# EAGLE design control_board (EAGLE 9.6.2)
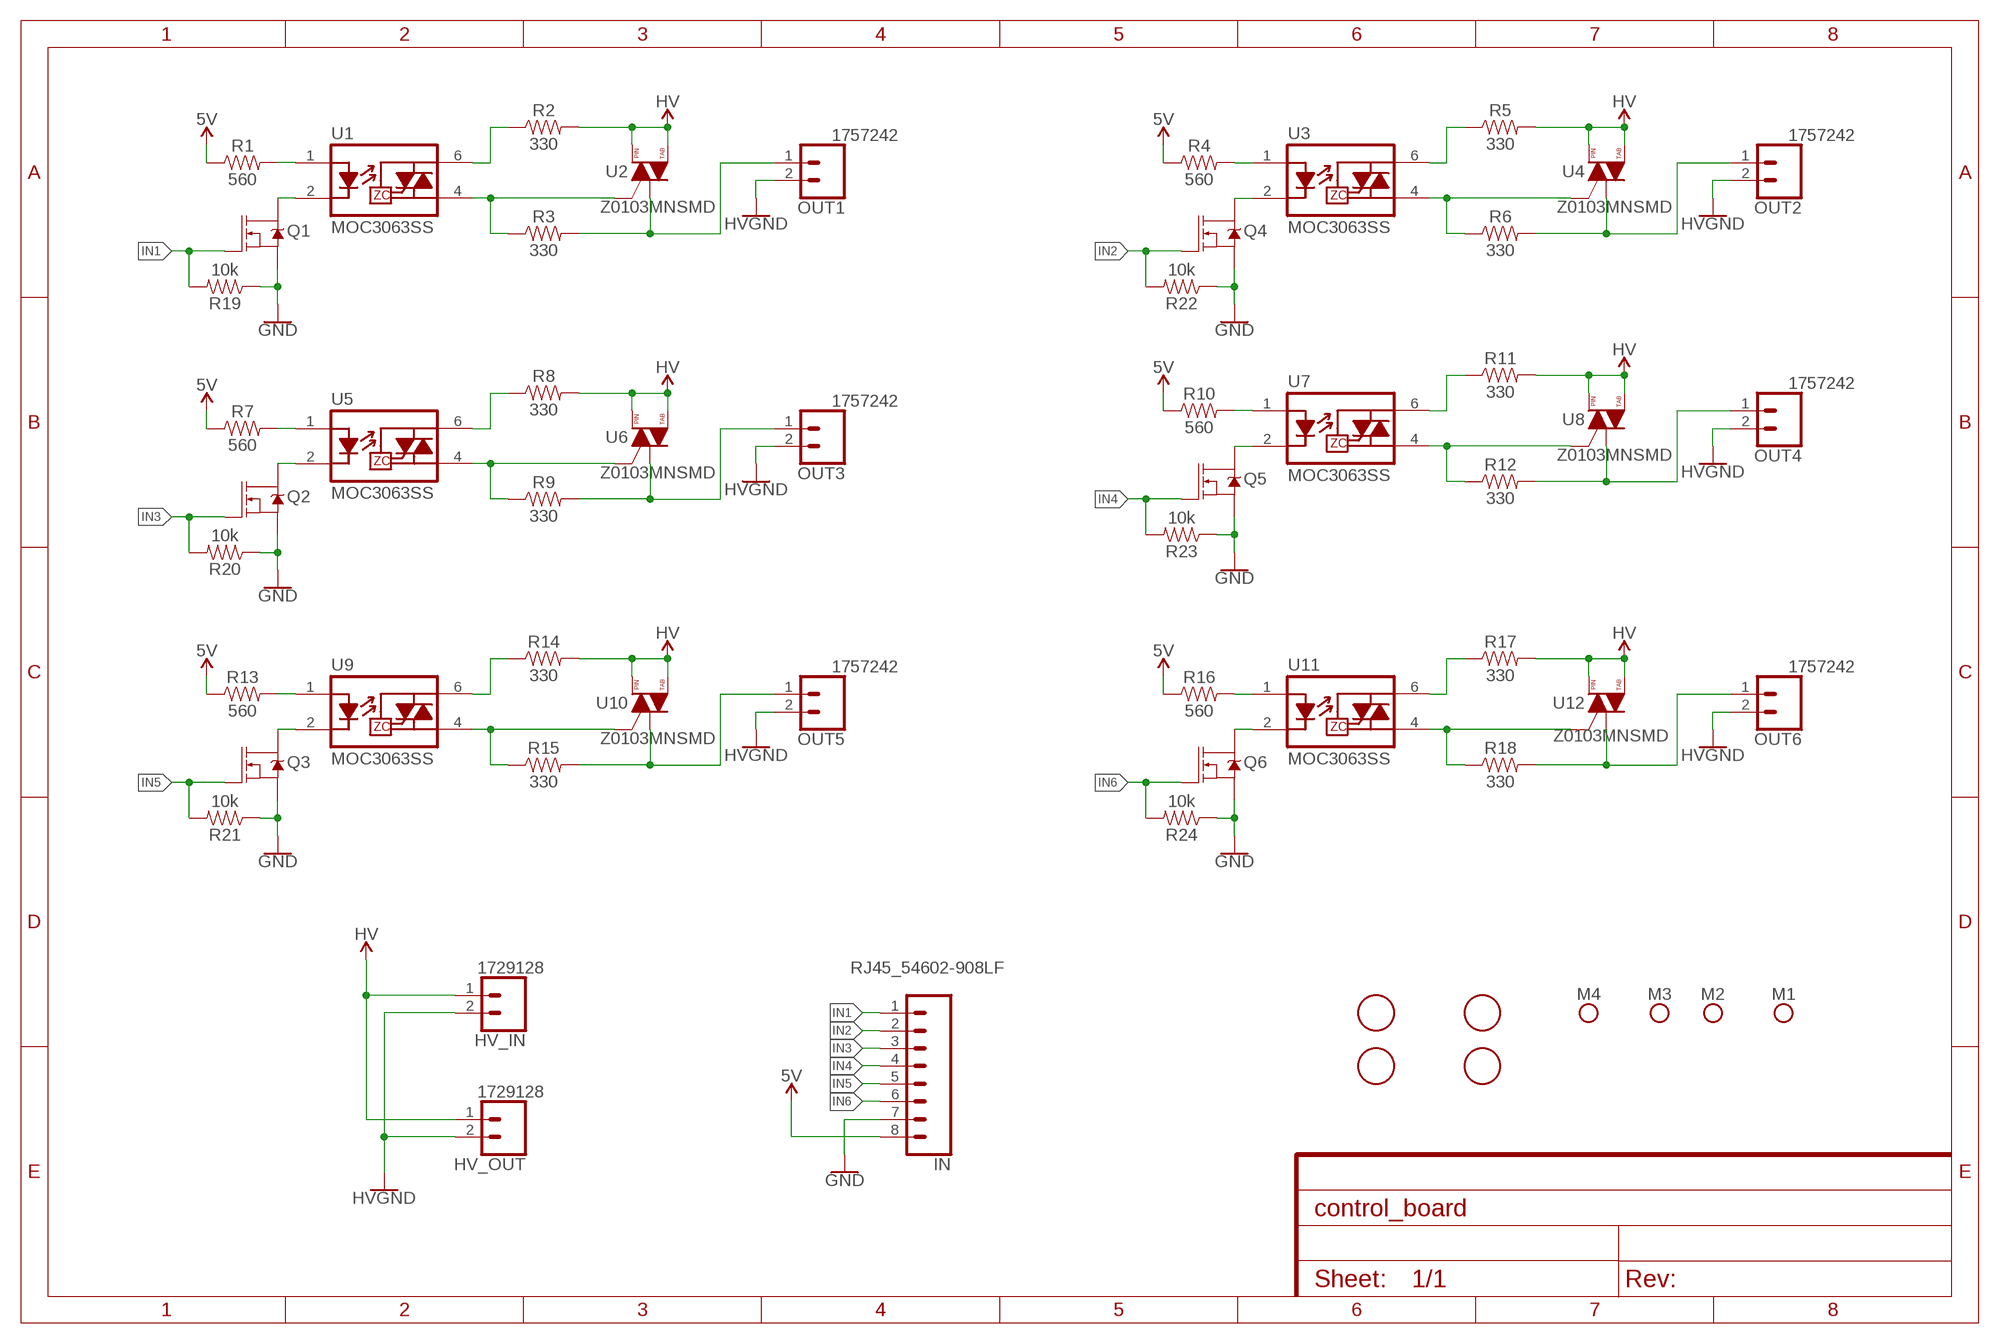
[diagram p0: schematic, sheet 1]

## Parts
HV_IN  1729128  [1729128]
HV_OUT  1729128  [1729128]
IN  RJ45_54602-908LF  [54602-908LF]
M1  NO_BOM  HOLE_ISOLATED-M2.5  [HOLE_ISOLATED_M2.5]
M2  NO_BOM  HOLE_ISOLATED-M2.5  [HOLE_ISOLATED_M2.5]
M3  NO_BOM  HOLE_ISOLATED-M2.5  [HOLE_ISOLATED_M2.5]
M4  NO_BOM  HOLE_ISOLATED-M2.5  [HOLE_ISOLATED_M2.5]
OUT1  1757242  [PHOENIX_1757242]
OUT2  1757242  [PHOENIX_1757242]
OUT3  1757242  [PHOENIX_1757242]
OUT4  1757242  [PHOENIX_1757242]
OUT5  1757242  [PHOENIX_1757242]
OUT6  1757242  [PHOENIX_1757242]
Q1  AO3400A  [SOT95P280X125-3N]
Q2  AO3400A  [SOT95P280X125-3N]
Q3  AO3400A  [SOT95P280X125-3N]
Q4  AO3400A  [SOT95P280X125-3N]
Q5  AO3400A  [SOT95P280X125-3N]
Q6  AO3400A  [SOT95P280X125-3N]
R1  560  RES-1/10W-5%-0603  [R0603]
R2  330  RES-1/10W-5%-0603  [R0603]
R3  330  RES-1/10W-5%-0603  [R0603]
R4  560  RES-1/10W-5%-0603  [R0603]
R5  330  RES-1/10W-5%-0603  [R0603]
R6  330  RES-1/10W-5%-0603  [R0603]
R7  560  RES-1/10W-5%-0603  [R0603]
R8  330  RES-1/10W-5%-0603  [R0603]
R9  330  RES-1/10W-5%-0603  [R0603]
R10  560  RES-1/10W-5%-0603  [R0603]
R11  330  RES-1/10W-5%-0603  [R0603]
R12  330  RES-1/10W-5%-0603  [R0603]
R13  560  RES-1/10W-5%-0603  [R0603]
R14  330  RES-1/10W-5%-0603  [R0603]
R15  330  RES-1/10W-5%-0603  [R0603]
R16  560  RES-1/10W-5%-0603  [R0603]
R17  330  RES-1/10W-5%-0603  [R0603]
R18  330  RES-1/10W-5%-0603  [R0603]
R19  10k  RES-1/10W-5%-0603  [R0603]
R20  10k  RES-1/10W-5%-0603  [R0603]
R21  10k  RES-1/10W-5%-0603  [R0603]
R22  10k  RES-1/10W-5%-0603  [R0603]
R23  10k  RES-1/10W-5%-0603  [R0603]
R24  10k  RES-1/10W-5%-0603  [R0603]
T1  NO_BOM  JLC_TOOLING_HOLE  [JLC_TOOLING_HOLE]
T2  NO_BOM  JLC_TOOLING_HOLE  [JLC_TOOLING_HOLE]
T3  NO_BOM  JLC_TOOLING_HOLE  [JLC_TOOLING_HOLE]
T4  NO_BOM  JLC_TOOLING_HOLE  [JLC_TOOLING_HOLE]
U1  MOC3063SS  [DIP8SMD]
U2  Z0103MNSMD  [SOT223]
U3  MOC3063SS  [DIP8SMD]
U4  Z0103MNSMD  [SOT223]
U5  MOC3063SS  [DIP8SMD]
U6  Z0103MNSMD  [SOT223]
U7  MOC3063SS  [DIP8SMD]
U8  Z0103MNSMD  [SOT223]
U9  MOC3063SS  [DIP8SMD]
U10  Z0103MNSMD  [SOT223]
U11  MOC3063SS  [DIP8SMD]
U12  Z0103MNSMD  [SOT223]

## Nets
5V: IN.8 R1.1 R4.1 R7.1 R10.1 R13.1 R16.1
GND: IN.7 Q1.2(S) Q2.2(S) Q3.2(S) Q4.2(S) Q5.2(S) Q6.2(S) R19.1 R20.1 R21.1 R22.1 R23.1 R24.1
HV: HV_IN.1 HV_OUT.1 R2.2 R5.2 R8.2 R11.2 R14.2 R17.2 U2.2(T2) U2.4(T2) U4.2(T2) U4.4(T2) U6.2(T2) U6.4(T2) U8.2(T2) U8.4(T2) U10.2(T2) U10.4(T2) U12.2(T2) U12.4(T2)
HVGND: HV_IN.2 HV_OUT.2 OUT1.2 OUT2.2 OUT3.2 OUT4.2 OUT5.2 OUT6.2
IN1: IN.1 Q1.1(G) R19.2
IN2: IN.2 Q4.1(G) R22.2
IN3: IN.3 Q2.1(G) R20.2
IN4: IN.4 Q5.1(G) R23.2
IN5: IN.5 Q3.1(G) R21.2
IN6: IN.6 Q6.1(G) R24.2
N$1: R16.2 U11.1(A)
N$2: R1.2 U1.1(A)
N$3: R2.1 U1.6(T1)
N$4: R5.1 U3.6(T1)
N$5: R3.1 U1.4(T2) U2.3(G)
N$6: OUT1.1 R3.2 U2.1(T1)
N$7: R6.1 U3.4(T2) U4.3(G)
N$8: OUT2.1 R6.2 U4.1(T1)
N$9: Q6.3(D) U11.2(K)
N$10: R8.1 U5.6(T1)
N$11: R9.1 U5.4(T2) U6.3(G)
N$12: OUT3.1 R9.2 U6.1(T1)
N$13: Q5.3(D) U7.2(K)
N$14: R11.1 U7.6(T1)
N$15: R12.1 U7.4(T2) U8.3(G)
N$16: OUT4.1 R12.2 U8.1(T1)
N$17: R10.2 U7.1(A)
N$18: R14.1 U9.6(T1)
N$19: R15.1 U9.4(T2) U10.3(G)
N$20: OUT5.1 R15.2 U10.1(T1)
N$21: Q4.3(D) U3.2(K)
N$22: R17.1 U11.6(T1)
N$23: R18.1 U11.4(T2) U12.3(G)
N$24: OUT6.1 R18.2 U12.1(T1)
N$25: Q1.3(D) U1.2(K)
N$26: Q3.3(D) U9.2(K)
N$27: R13.2 U9.1(A)
N$28: Q2.3(D) U5.2(K)
N$29: R7.2 U5.1(A)
N$30: R4.2 U3.1(A)

## Library data of the parts
HV_IN HV_OUT = Inventas-Connectors:1729128: PCB terminal block, nominal current: 13.5 A, rated voltage (III/2): 400 V, nominal cross section: 1.5 mm?, Number of potentials: 2, Number of rows: 1, Number of positions per row: 2, product range: MKDSN 1,5, pitch: 5.08 mm, connection method: Screw connection with tension sleeve, mounting: Wave soldering, conductor/PCB connection direction: 0 ?, color: green, Pin layout: Linear pinning, Solder pin [P]: 3.5 mm, type of packaging: packed in cardboard Source: Datasheet <http://www.phoenixcontact.net/product/1729128>; ARROW_PART_NUMBER: 1729128; ARROW_PRICE-STOCK: https://www.arrow.com/en/products/1729128/phoenix-contact?region=nac; DESCRIPTION: PCB terminal block, nominal current: 13.5 A, rated voltage (III/2): 400 V, nominal cross section: 1.5 mm?, Number of potentials: 2, Number of rows: 1, Number of positions per row: 2, product range: MKDSN 1,5, pitch: 5.08 mm, connection method: Screw connection with tension sleeve, mounting: Wave soldering, conductor/PCB connection direction: 0 ?, color: green, Pin layout: Linear pinning, Solder pin [P]: 3.5 mm, type of packaging: packed in cardboard; HEIGHT: 10.15mm; JLC_PART_NUMBER: 1729128; MANUFACTURER_NAME: Phoenix Contact; MANUFACTURER_PART_NUMBER: 1729128; MOUSER_PART_NUMBER: 651-1729128; MOUSER_PRICE-STOCK: https://www.mouser.co.uk/ProductDetail/Phoenix-Contact/1729128?qs=GFUSqQMLmmnCBVBY3dts9w%3D%3D
IN = Inventas-Connectors:RJ45_54602-908LF; JLC_PART_NUMBER: C2847314; MANUFACTURER_NAME: Amphenol ICC (FCI); MANUFACTURER_PART_NUMBER: 54602-908LF
M1-M4 = Inventas-Misc:HOLE_ISOLATED
OUT1-OUT6 = Inventas-Connectors:1757242: Phoenix 1757242 MSTBA 2.5/ 2-G-5.08 Base Strip/Header 4 Kilo-Volt Surge 320 Volt Rated III/2 12 Amp Green Plug-In; DESCRIPTION: 2 Position Terminal Block Header, Male Pins, Shrouded (4 Side) 0.200 (5.08mm) 90°, Right Angle - Through Hole; DIGI-KEY_PART_NUMBER: 277-1106-ND; JLC_PART_NUMBER: C90074; MANUFACTURER_NAME: Phoenix Contact; MANUFACTURER_PART_NUMBER: 1757242; PACKAGE: None; PURCHASE-URL: https://pricing.snapeda.com/search/part/1757242/?ref=eda
Q1-Q6 = inventas-DiscreteSemi:AO3400A: 30V N-Channel MOSFET Source: Datasheet <http://aosmd.com/res/data_sheets/AO3400A.pdf>; ARROW_PART_NUMBER: AO3400A; ARROW_PRICE-STOCK: https://www.arrow.com/en/products/ao3400a/alpha-and-omega-semiconductor?region=nac; DESCRIPTION: 30V N-Channel MOSFET; HEIGHT: 1.25mm; JLC_PART_NUMBER: C20917; MANUFACTURER_NAME: Alpha & Omega Semiconductors; MANUFACTURER_PART_NUMBER: AO3400A
R1 R4 R7 R10 R13 R16 = Inventas-Passives:RES-1/10W-5%-: Generic Resistor Package; JLC_PART_NUMBER: C23204
R2 R3 R5 R6 R8 R9 R11 R12 R14 R15 R17 R18 = Inventas-Passives:RES-1/10W-5%-: Generic Resistor Package; JLC_PART_NUMBER: C23138
R19-R24 = Inventas-Passives:RES-1/10W-5%-: Generic Resistor Package; JLC_PART_NUMBER: C25804
T1-T4 = Inventas-Misc:JLC_TOOLING_HOLE
U1 U3 U5 U7 U9 U11 = inventas-DiscreteSemi:MOC3063S: Optotriac in DIP and SMD LED: Vf: 1.2V If: 5 mA TRIAC Vdrm: 600V Itsm: 1A Viso: 5000V DV/dt: 1500V/us DIP: MOC3063 SMD: MOC3063S; JLC_PART_NUMBER: C77950; MANUFACTURER_NAME: Lite-On; MANUFACTURER_PART_NUMBER: MOC3063S; PROD_ID: IC-10683
U2 U4 U6 U8 U10 U12 = inventas-DiscreteSemi:Z0103MN: TRIAC High Power Used for EL wire applications; JLC_PART_NUMBER: C163595; MANUFACTURER_NAME: STMicroelectronics; MANUFACTURER_PART_NUMBER: Z0103MN 5AA4; PROD_ID: VREG-09120

## Board
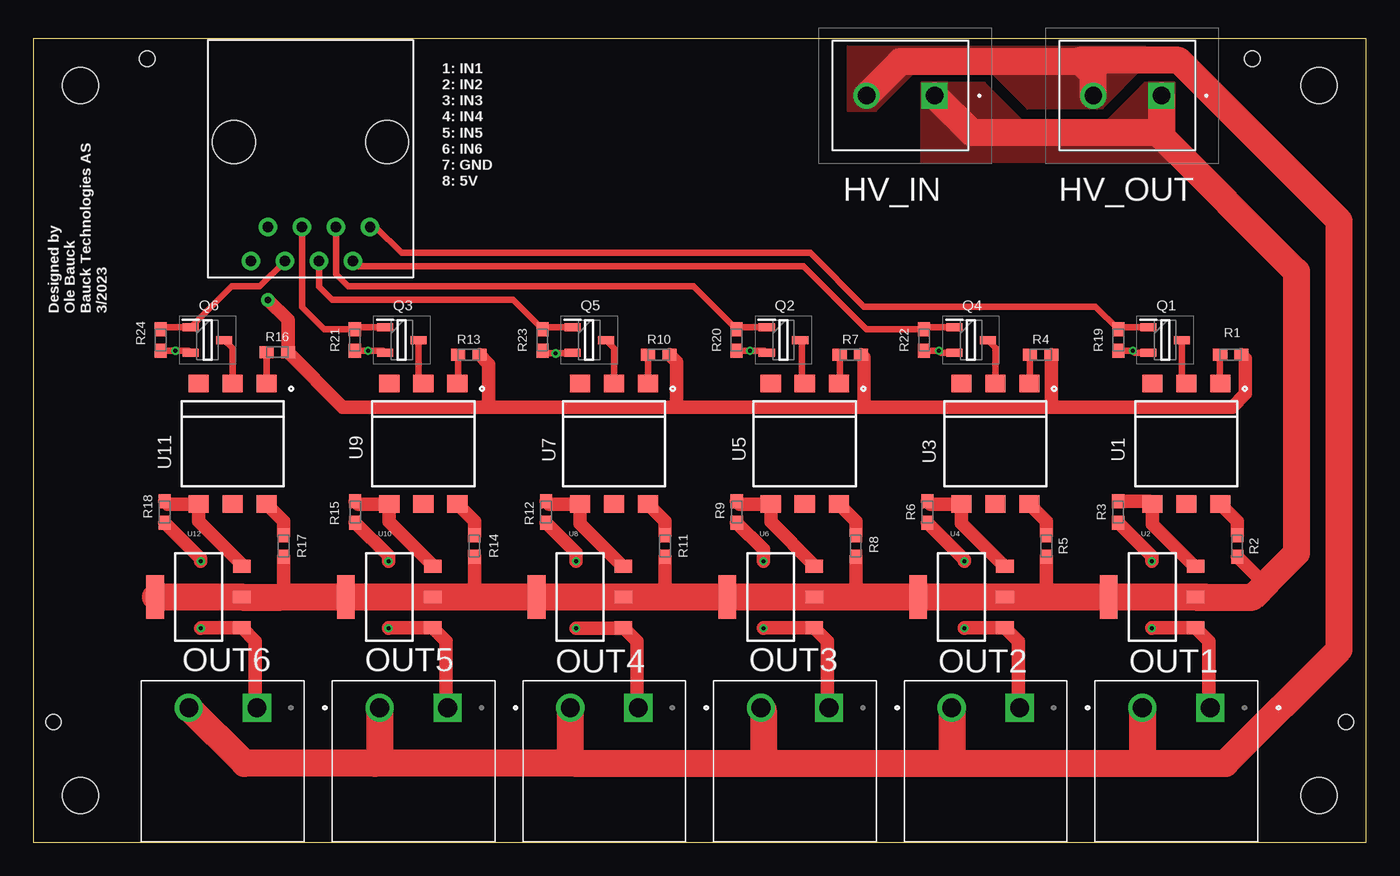
[diagram p1: board, top side]
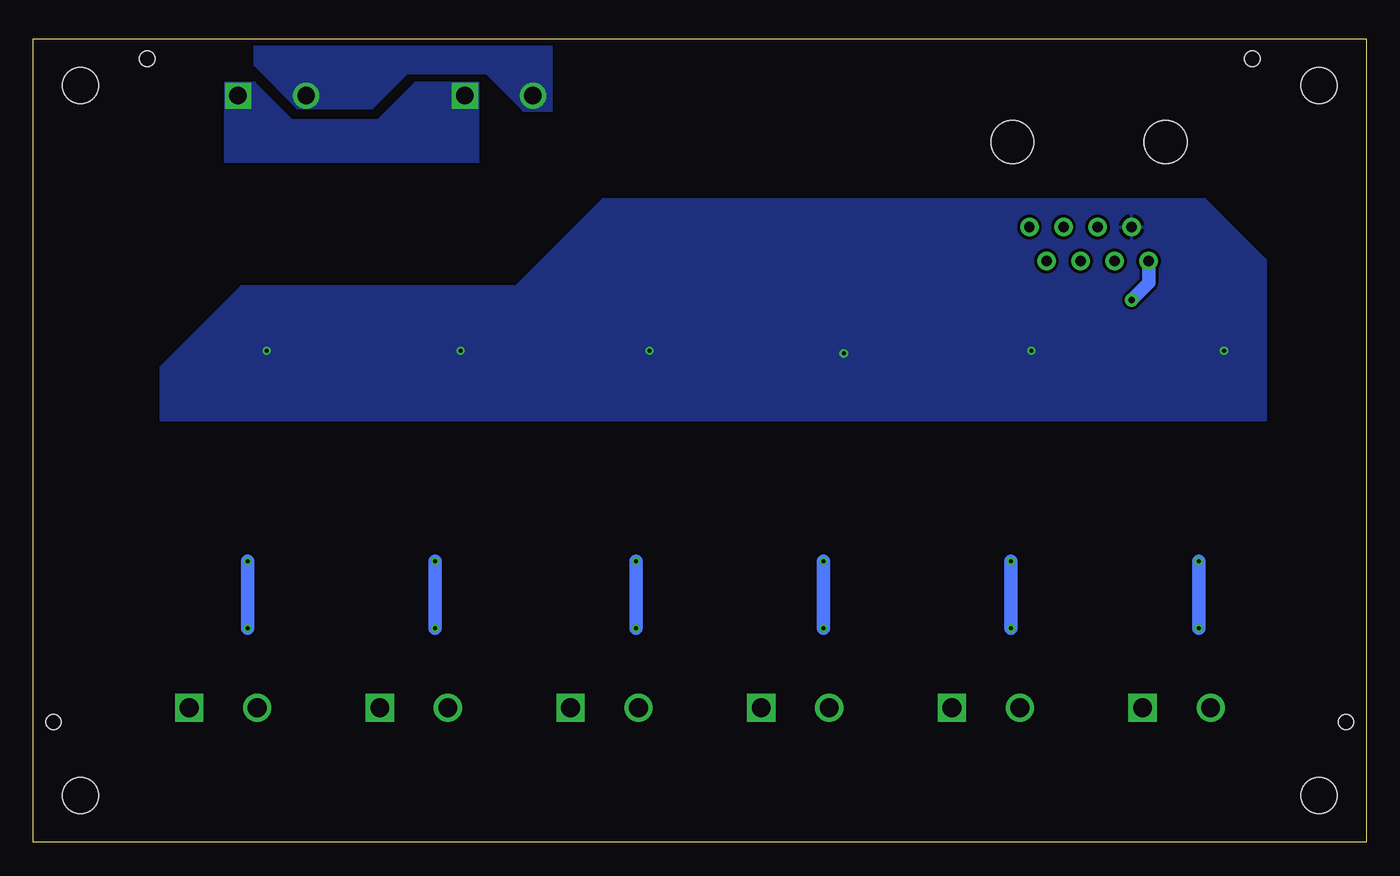
[diagram p2: board, bottom side, seen from below]

Size 99.5 x 60 mm. Coordinates in mm from the lower left corner, seen from the top.
Outline: 0,0 99.5,0 99.5,60 0,60 0,0
Copper layers (1*16): Top 0.035mm / dielectric 1.6mm / Bottom 0.035mm
Design rules "2-layer_rule": minimum track width 0.2mm, minimum drill 0.3mm, track to track 0.2mm, track to pad 0.2mm, pad to pad 0.2mm, via to via 0.2mm, smd to smd 0mil, copper to edge 20mil, drill to drill 10mil, minimum pad ring 6mil, minimum via ring 6mil, stop-mask expansion 0.07mm, vias tented up to drill 100mil, thermal gap 10mil

### Footprints (pad centres in the part's own frame; a part is rotated, then mirrored left to right if it is on the bottom)
1729128 = drill 1.3 pad 1.95 square: 1 -2.54,0 | drill 1.3 pad 1.95: 2 2.54,0
54602-908LF = drill 0.76 pad 1.4: 1 -4.445,5.1; 2 -3.175,7.64; 3 -1.905,5.1; 4 -0.635,7.64; 5 0.635,5.1; 6 1.905,7.64; 7 3.175,5.1; 8 4.445,7.64 | hole 3.2: 5.715,-1.25; -5.715,-1.25
HOLE_ISOLATED_M2.5 = hole 2.7: 0,0
PHOENIX_1757242 = drill 1.4 square: 1 2.54,0 | drill 1.4: 2 -2.54,0
SOT95P280X125-3N = smd 1.2 x 0.6: 1 1.25,-0.95; 2 1.25,0.95; 3 -1.25,0
R0603 = smd 1.05 x 0.9: 1 -0.8,0; 2 0.8,0
JLC_TOOLING_HOLE = hole 1.152: 0,0
DIP8SMD = smd 1.5 x 1.3: 1 -2.54,-4.5; 2 0,-4.5; 3 2.54,-4.5; 4 2.54,4.5; 5 0,4.5; 6 -2.54,4.5
SOT223 = smd 1.32 x 0.95: 1 3.24,-2.3; 2 3.24,0; 3 3.24,2.3 | smd 1.32 x 3.25: 4 -3.24,0

### Placement (x,y rotation side)
HV_IN  64.74,55.75 180 top
HV_OUT  81.68,55.75 180 top
IN  20.68,51.04 180 top
M1  3.5,3.5 0 top
M2  96,3.5 0 top
M3  96,56.5 0 top
M4  3.5,56.5 0 top
OUT1  85.34,10.06 0 top
OUT2  71.1,10.06 0 top
OUT3  56.86,10.06 0 top
OUT4  42.62,10.06 0 top
OUT5  28.38,10.06 0 top
OUT6  14.14,10.06 0 top
Q1  84.5,37.5 180 top
Q2  56,37.5 180 top
Q3  27.5,37.5 180 top
Q4  70,37.5 180 top
Q5  41.5,37.5 180 top
Q6  13,37.5 180 top
R1  89.4,36.4 180 top
R2  89.88,22.13 270 top
R3  80.99,24.67 270 top
R4  75.2,36.4 180 top
R5  75.64,22.13 270 top
R6  66.75,24.67 270 top
R7  61,36.4 180 top
R8  61.4,22.13 270 top
R9  52.51,24.67 270 top
R10  46.7,36.4 180 top
R11  47.16,22.13 270 top
R12  38.27,24.67 270 top
R13  32.5,36.4 180 top
R14  32.92,22.13 270 top
R15  24.03,24.67 270 top
R16  18.2,36.6 180 top
R17  18.68,22.13 270 top
R18  9.79,24.67 270 top
R19  81,37.5 90 top
R20  52.5,37.5 90 top
R21  24,37.5 90 top
R22  66.5,37.5 90 top
R23  38,37.5 90 top
R24  9.5,37.5 90 top
T1  8.5,58.5 0 top
T2  91,58.5 0 top
T3  1.5,9 0 top
T4  98,9 0 top
U1  86.07,29.75 180 top
U2  83.53,18.32 0 top
U3  71.83,29.75 180 top
U4  69.29,18.32 0 top
U5  57.59,29.75 180 top
U6  55.05,18.32 0 top
U7  43.35,29.75 180 top
U8  40.81,18.32 0 top
U9  29.11,29.75 180 top
U10  26.57,18.32 0 top
U11  14.87,29.75 180 top
U12  12.33,18.32 0 top

### Tracks (layer width: path | path; a pad name or v marks a point on that pad's centre or on a via)
5V  (via drill 0.5 pad 1)
  Top 1: 34,32.5 23.1,32.5 R16.1 19,39 v17.5,40.5 | 34,32.5 48,32.5 | 48,32.5 62,32.5 | 62,32.5 76,32.5 | 76,32.5 89.5,32.5 90.5,33.5 90.5,36.1 R1.1 | 76,32.5 R4.1 | 62,32.5 62,36.2 R7.1 | 48,32.5 48,35.9 R10.1 | 34,32.5 34,35.7 R13.1
  Bottom 1: IN.8 16.23,41.77 v17.5,40.5
GND  (via drill 0.3 pad 0.6)
  Top 0.5: R24.1 v10.6,36.7 11.6,36.7 Q6.2 | R21.1 v25,36.7 26.1,36.7 Q3.2 | R23.1 38.2,36.5 v39,36.5 40.2,36.5 Q5.2 | R20.1 v53.5,36.7 54.6,36.7 Q2.2 | R22.1 v67.6,36.7 67.75,36.55 Q4.2 | R19.1 v82.1,36.7 82.25,36.55 Q1.2
  pour Bottom: 12,48 57,48 63.5,41.5 84,41.5 90,35.5 90,31.5 7.5,31.5 7.5,43.5
HV
  Top 1: R5.2 75.64,18.46 75.5,18.32 | R2.2 91.71,19.5 92.21,19.5 | U2.2 87.5,18.32 | U4.2 73.5,18.32 | U2.4 79.5,18.32 | U4.4 65.5,18.32 | R8.2 61.4,18.42 61.5,18.32 | U6.2 59.5,18.32 | U6.4 52.5,18.32 | R11.2 47.16,18.66 47.5,18.32 | U8.2 44.5,18.32 | R14.2 32.92,18.9 33.5,18.32 | R17.2 18.68,18.5 18.5,18.32 | U10.4 22.5,18.32 | U10.2 30.5,18.32 | U8.4 36.5,18.32
  Top 2: HV_IN.1 70.03,53 83.9,53 94.3,42.6 94.3,21.59 92.21,19.5 91.03,18.32 U2.2 | 87.5,18.32 79.5,18.32 75.5,18.32 73.5,18.32 65.5,18.32 61.5,18.32 59.5,18.32 52.5,18.32 47.5,18.32 44.5,18.32 36.5,18.32 33.5,18.32 30.5,18.32 22.5,18.32 18.5,18.32 U12.2 U12.4 | HV_OUT.1 84.22,53
  pour Top (no thermals): 66.3,56.7 66.3,50.8 85.2,50.8 85.2,56.7 83,56.7 80.2,53.9 73.8,53.9 71,56.7
  pour Bottom (no thermals): 66.3,56.7 66.3,50.8 85.2,50.8 85.2,56.7 83,56.7 80.2,53.9 73.8,53.9 71,56.7
HVGND
  Top 2: 40.5,5.9 25.5,5.9 | 40.5,5.9 54.5,5.9 | 54.5,5.9 68.5,5.9 | 68.5,5.9 82.5,5.9 | 82.5,5.9 89,5.9 97.5,14.4 97.5,46.4 85.52,58.38 78.1,58.38 78.2,58.28 | HV_IN.2 64.73,58.28 78.2,58.28 | HV_OUT.2 79.14,57.34 78.2,58.28 | OUT5.2 25.84,6.24 25.5,5.9 | OUT4.2 40.08,6.32 40.5,5.9 | OUT3.2 54.5,9.88 54.5,5.9 | OUT2.2 68.56,5.96 68.5,5.9 | OUT1.2 82.8,6.2 82.5,5.9 | 25.5,5.9 15.76,5.9 OUT6.2
  pour Top (no thermals): 60.8,54.6 62.9,54.6 65.7,57.4 71.6,57.4 74.2,54.8 79.8,54.8 83,58 83,61.1 60.8,61.1
  pour Bottom (no thermals): 60.8,54.6 62.9,54.6 65.7,57.4 71.6,57.4 74.2,54.8 79.8,54.8 83,58 83,61.1 60.8,61.1
IN1
  Top 0.5: IN.1 25.56,45.94 27.5,44 58,44 62,40 79.3,40 R19.2 81.15,38.45 Q1.1
IN2
  Top 0.5: IN.2 24.25,43 57.5,43 62.2,38.3 R22.2 66.65,38.45 Q4.1
IN3
  Top 0.5: IN.3 22.59,42.41 23.5,41.5 49.3,41.5 52.4,38.4 | R20.2 52.4,38.4 | Q2.1 52.45,38.45 52.4,38.4
IN4
  Top 0.5: IN.4 21.32,41.48 22.3,40.5 35.8,40.5 R23.2 38.15,38.45 Q5.1
IN5
  Top 0.5: IN.5 20.05,39.95 21.7,38.3 R21.2 24.15,38.45 Q3.1
IN6
  Top 0.5: IN.6 16.88,41.5 14.8,41.5 Q6.1 9.65,38.45 R24.2
N$1
  Top 0.5: R16.2 U11.1
N$2
  Top 0.5: R1.2 U1.1
N$3
  Top 1: U1.6 89.88,23.98 R2.1
N$4
  Top 1: U3.6 75.64,23.98 R5.1
N$5
  Top 1: R3.1 83.31,25.47 U1.4 83.53,23.77 86.68,20.62 U2.3
N$6  (via drill 0.3 pad 0.6)
  Top 1: R3.2 83.5,21.36 v83.5,21 | v83.5,16 83.52,16.02 U2.1 87.77,15.02 87.77,10.17 OUT1.1
  Bottom 1: v83.5,21 v83.5,16
N$7
  Top 1: U4.3 72.48,20.62 69.29,23.81 U3.4 66.97,25.25 R6.1
N$8  (via drill 0.3 pad 0.6)
  Top 1: R6.2 69.5,21.12 v69.5,21 | v69.5,16 69.52,16.02 U4.1 73.53,15.02 73.53,10.17 OUT2.1
  Bottom 1: v69.5,21 v69.5,16
N$9
  Top 0.5: Q6.3 14.87,36.88 U11.2
N$10
  Top 1: U5.6 61.4,23.98 R8.1
N$11
  Top 1: U6.3 58.29,20.71 55.05,23.95 U5.4 52.73,25.25 R9.1
N$12  (via drill 0.3 pad 0.6)
  Top 1: R9.2 54.5,21.88 v54.5,21 | v54.5,16 54.52,16.02 U6.1 59.29,15.02 59.29,10.17 OUT3.1
  Bottom 1: v54.5,21 v54.5,16
N$13
  Top 0.5: Q5.3 43.35,36.9 U7.2
N$14
  Top 1: U7.6 47.16,23.98 R11.1
N$15
  Top 1: U8.3 43.98,20.62 40.81,23.79 U7.4 38.49,25.25 R12.1
N$16  (via drill 0.3 pad 0.6)
  Top 1: OUT4.1 45.05,10.17 45.05,15.02 U8.1 44.03,16 v40.5,16 | R12.2 40.5,21.64 v40.5,21
  Bottom 1: v40.5,21 v40.5,16
N$17
  Top 0.5: R10.2 U7.1
N$18
  Top 1: U9.6 32.92,23.98 R14.1
N$19
  Top 1: U10.3 29.81,20.69 26.57,23.93 U9.4 24.25,25.25 R15.1
N$20  (via drill 0.3 pad 0.6)
  Top 1: OUT5.1 30.81,10.17 30.81,15.02 U10.1 26.52,16.02 v26.5,16 | R15.2 26.5,21.4 v26.5,21
  Bottom 1: v26.5,21 v26.5,16
N$21
  Top 0.5: U3.2 71.83,36.92 Q4.3
N$22
  Top 1: U11.6 18.68,23.98 R17.1
N$23
  Top 1: U12.3 15.57,20.73 12.33,23.97 U11.4 10.01,25.25 R18.1
N$24  (via drill 0.3 pad 0.6)
  Top 1: OUT6.1 16.57,10.17 16.57,15.02 U12.1 12.52,16.02 v12.5,16 | R18.2 12.5,21.16 v12.5,21
  Bottom 1: v12.5,21 v12.5,16
N$25
  Top 0.5: Q1.3 85.75,34.57 U1.2
N$26
  Top 0.5: Q3.3 28.75,34.61 U9.2
N$27
  Top 0.5: R13.2 31.7,34.3 U9.1
N$28
  Top 0.5: Q2.3 57.39,37.36 57.39,34.45 U5.2
N$29
  Top 0.5: R7.2 60.2,34.32 U5.1
N$30
  Top 0.5: R4.2 74.4,34.28 U3.1

### Text on the board
tNames: 1: IN1 / 2: IN2 / 3: IN3 / 4: IN4 / 5: IN5 / 6: IN6 / 7: GND / 8: 5V | Designed by / Ole Bauck / Bauck Technologies AS / 3/2023